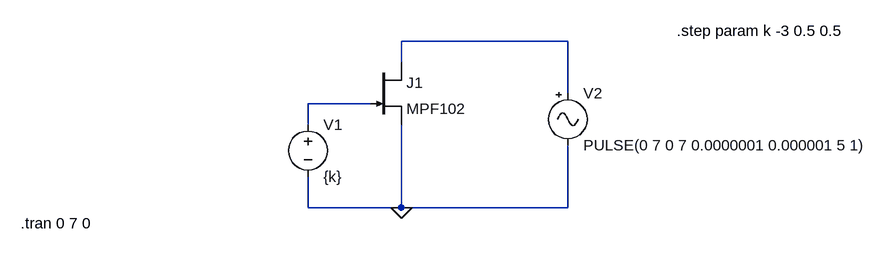
[diagram p0: schematic jfet.asc]
jfet.asc, the LTspice schematic file:
Version 4
SHEET 1 2572 680
WIRE 464 112 208 112
WIRE 208 144 208 112
WIRE 464 192 464 112
WIRE 160 208 64 208
WIRE 64 240 64 208
WIRE 64 368 64 320
WIRE 208 368 208 240
WIRE 208 368 64 368
WIRE 464 368 464 272
WIRE 464 368 208 368
FLAG 208 368 0
SYMBOL njf 160 144 R0
SYMATTR InstName J1
SYMATTR Value MPF102
SYMBOL voltage 64 224 R0
SYMATTR InstName V1
SYMATTR Value {k}
SYMBOL Misc\\signal 464 176 R0
WINDOW 123 0 0 Left 2
WINDOW 39 0 0 Left 2
SYMATTR InstName V2
SYMATTR Value PULSE(0 7 0 7 0.0000001 0.000001 5 1)
TEXT -378 392 Left 2 !.tran 0 7 0
TEXT 632 96 Left 2 !.step param k -3 0.5 0.5

The netlist it stands for:
* jfet.asc
J1 N001 N002 0 MPF102
V1 N002 0 {k}
V2 N001 0 PULSE(0 7 0 7 0.0000001 0.000001 5 1)
.model NJF NJF
.model PJF PJF
.lib standard.jft
.tran 0 7 0
.step param k -3 0.5 0.5
.backanno
.end